# EAGLE schematic amplification (EAGLE 7.5.0)
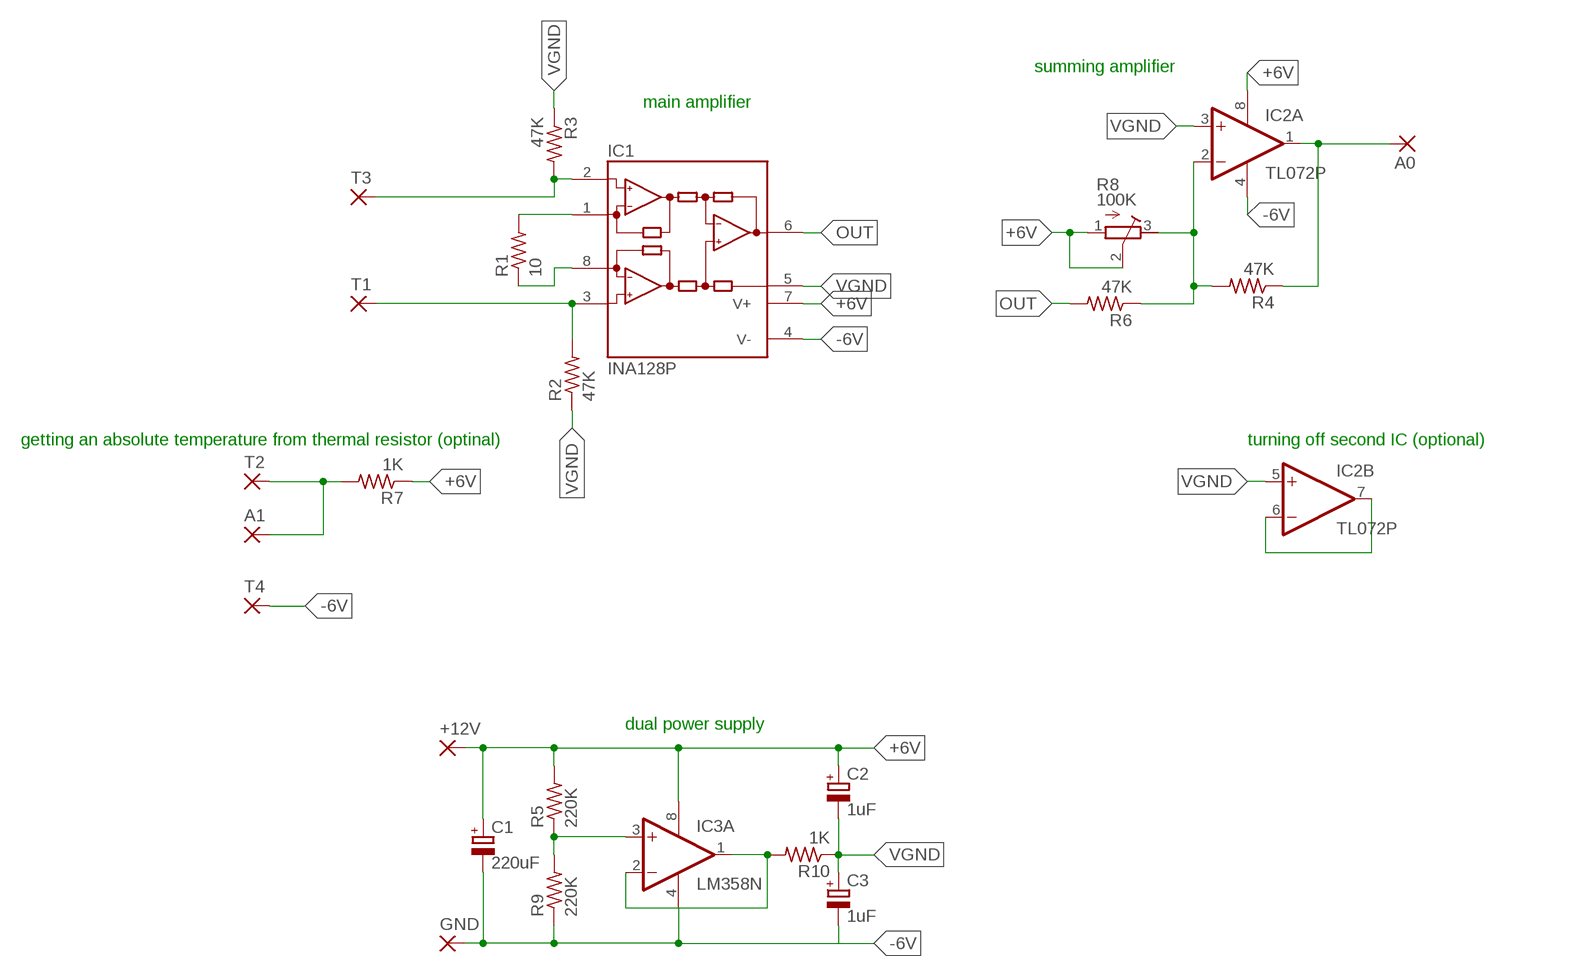
[diagram p0: schematic, sheet 1]

## Parts
+12V  2,54/0,8  [2,54/0,8]
A0  2,54/0,8  [2,54/0,8]
A1  2,54/0,8  [2,54/0,8]
C1  220uF  CPOL-EUE2.5-6  [E2,5-6]
C2  1uF  CPOL-EUE2.5-6  [E2,5-6]
C3  1uF  CPOL-EUE2.5-6  [E2,5-6]
GND  2,54/0,8  [2,54/0,8]
IC1  INA128P  [DIL08]
IC2  TL072P  [DIL08]
IC3  LM358N  [DIL08]
R1  10  R-US_0207/10  [0207/10]
R2  47K  R-US_0207/10  [0207/10]
R3  47K  R-US_0207/10  [0207/10]
R4  47K  R-US_0207/10  [0207/10]
R5  220K  R-US_0207/10  [0207/10]
R6  47K  R-US_0207/10  [0207/10]
R7  1K  R-US_0207/10  [0207/10]
R8  100K  R-TRIMM64W  [RTRIM64W]
R9  220K  R-US_0207/10  [0207/10]
R10  1K  R-US_0207/10  [0207/10]
T1  2,54/0,8  [2,54/0,8]
T2  2,54/0,8  [2,54/0,8]
T3  2,54/0,8  [2,54/0,8]
T4  2,54/0,8  [2,54/0,8]

## Nets
+6V: +12V.1(P) C1.+ C2.+ IC1.7(V+) IC2.8(P:V+) IC3.8(P:V+) R5.2 R7.1 R8.1(A) R8.2(S)
-6V: C1.- C3.- GND.1(P) IC1.4(V-) IC2.4(P:V-) IC3.4(P:V-) R9.1 T4.1(P)
N$1: IC2.2(A:-IN) R4.2 R6.1 R8.3(E)
N$2: IC2.6(B:-IN) IC2.7(B:OUT)
N$3: A0.1(P) IC2.1(A:OUT) R4.1
N$6: IC3.1(A:OUT) IC3.2(A:-IN) R10.2
N$7: IC1.1(RG) R1.2
N$8: IC1.8(RG) R1.1
N$10: IC1.2(-IN) R3.2 T3.1(P)
N$11: A1.1(P) R7.2 T2.1(P)
N$12: IC3.3(A:+IN) R5.1 R9.2
OUT: IC1.6(OUT) R6.2
THERMOPILE-: IC1.3(+IN) R2.2 T1.1(P)
VGND: C2.- C3.+ IC1.5(REF) IC2.3(A:+IN) IC2.5(B:+IN) R2.1 R3.1 R10.1
Unconnected: IC3.5(B:+IN) IC3.6(B:-IN) IC3.7(B:OUT)

## Notes on the sheet
- summing amplifier
- main amplifier
- getting an absolute temperature from thermal resistor (optinal) | turning off second IC (optional)
- dual power supply

## Library data of the parts
+12V A0 A1 GND T1-T4 = wirepad:2,54/0,8: THROUGH-HOLE PAD
C1-C3 = resistor:CPOL-EU: POLARIZED CAPACITOR, European symbol
IC1 = burr-brown:INA128: Instrumentation Amplifiers Precision, Low Power; MF: TEXAS INSTRUMENTS; MPN: INA128P; OC_FARNELL: 1212410; OC_NEWARK: 74C9783
IC2 = linear:TL072: OP AMP
IC3 = linear:LM358: OP AMP also LM158; LM258; LM2904 Source: http://cache.national.com/ds/LM/LM158.pdf
R1-R7 R9 R10 = resistor:R-US_: RESISTOR, American symbol
R8 = rcl:R-TRIMM: Trimm resistor